# Altium schematic sheet TopLevel.SCHDOC
size A4
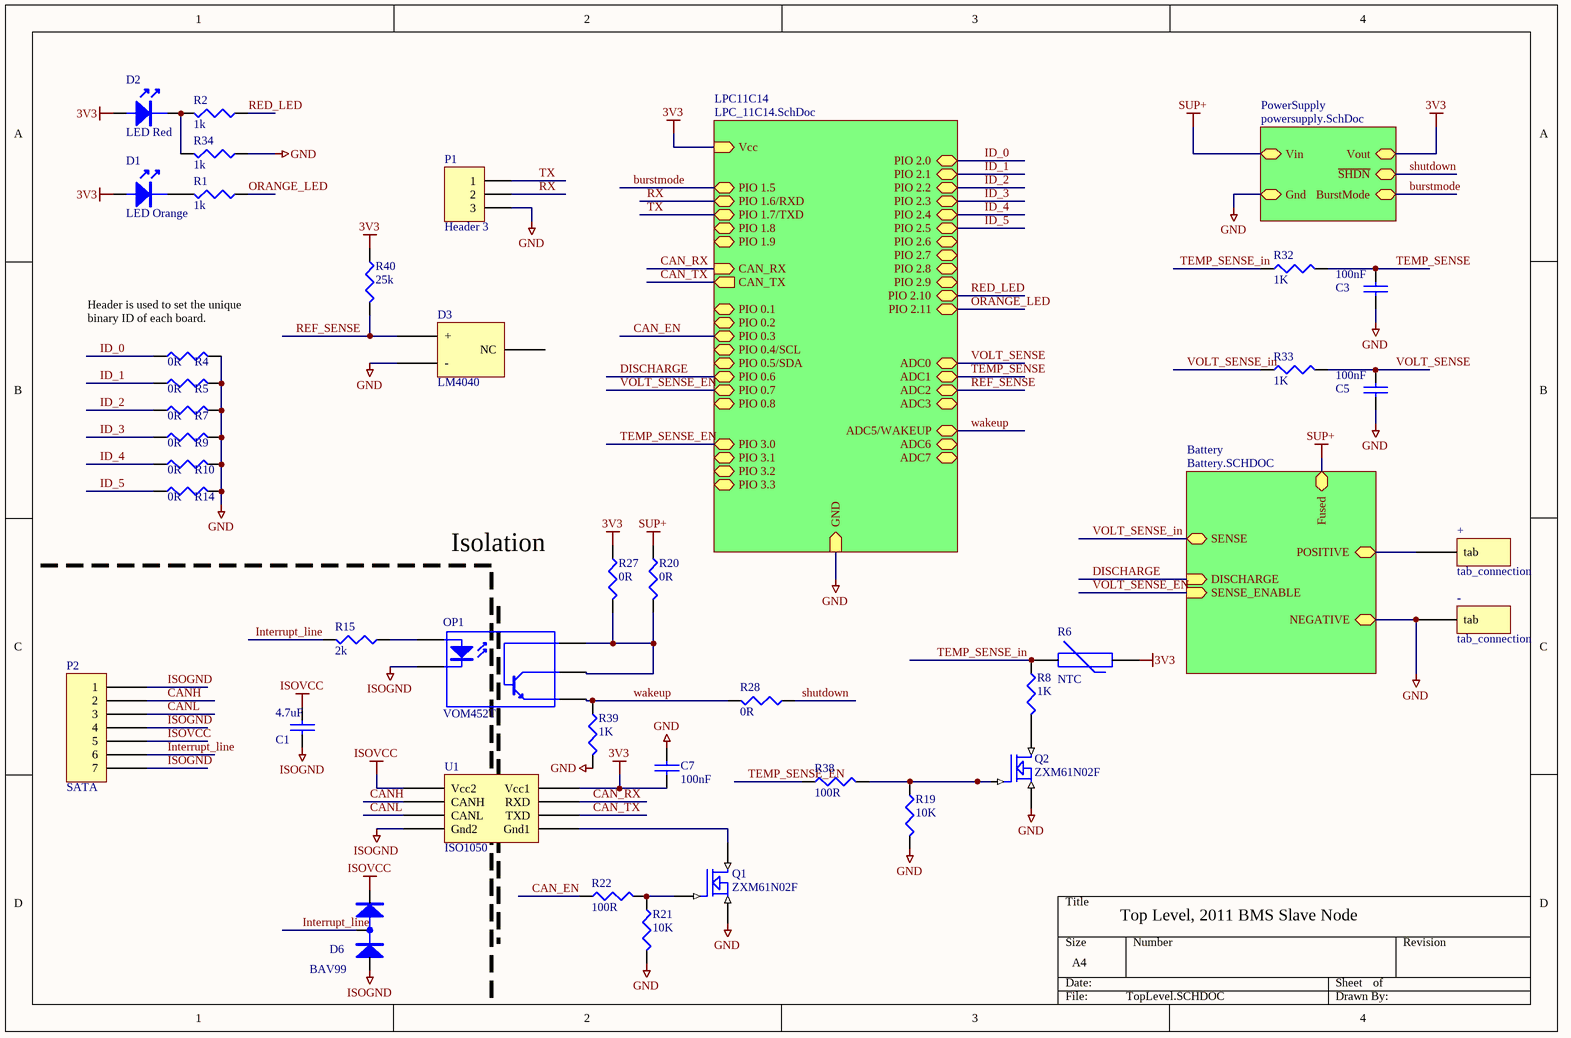
[diagram p0: TopLevel.SCHDOC]

## Parts
+  tab_connection  [tab_connect]
-  tab_connection  [tab_connect]
C1  4.7uF  [0805]
C3  100nF  [0603]
C5  100nF  [0603]
C7  100nF  [0603]
D1  LED Orange  [0603_LED]
D2  LED Red  [0603_LED]
D3  LM4040  [SOT23-3]
D6  BAV99  [BAV99]
OP1  VOM452T  [VOM452T]
P1  Header 3  [HDR1X3]
P2  SATA  [47080-4005-SATA]
Q1  ZXM61N02F  [SOT23-3]
Q2  ZXM61N02F  [SOT23-3]
R1  1k  [0603]
R2  1k  [0603]
R4  0R  [0603]
R5  0R  [0603]
R6  NTC  [MHDR1X2]
R7  0R  [0603]
R8  1K  [0603]
R9  0R  [0603]
R10  0R  [0603]
R14  0R  [0603]
R15  2k  [0603]
R19  10K  [0603]
R20  0R  [0603]
R21  10K  [0603]
R22  100R  [0603]
R27  0R  [0603]
R28  0R  [0603]
R32  1K  [0603]
R33  1K  [0603]
R34  1k  [0603]
R38  100R  [0603]
R39  1K  [0603]
R40  25k  [0603]
U1  ISO1050  [SOP8]

## Sub-sheets
Battery = Battery.SCHDOC: DISCHARGE (in), SENSE_ENABLE (in), SENSE (bidir), Fused, POSITIVE, NEGATIVE
LPC11C14 = LPC_11C14.SchDoc: ADC5/WAKEUP (bidir), ADC6 (bidir), CAN_TX (out), CAN_RX (in), ADC7, Vcc (in), GND (in), ADC3 (bidir), ADC2 (bidir), ADC1 (bidir), ADC0 (bidir), PIO 0.4/SCL (bidir), PIO 0.5/SDA (bidir), PIO 0.7 (bidir), PIO 0.6 (bidir), PIO 0.1 (bidir), PIO 0.2, PIO 0.3, PIO 0.8, PIO 1.6/RXD (bidir), PIO 1.7/TXD (bidir), PIO 1.5, PIO 1.8, PIO 1.9, PIO 3.0 (bidir), PIO 3.1 (bidir), PIO 3.2, PIO 3.3, PIO 2.9 (bidir), PIO 2.8 (bidir), PIO 2.7 (bidir), PIO 2.11 (bidir), PIO 2.10 (bidir), PIO 2.3 (bidir), PIO 2.2 (bidir), PIO 2.1 (bidir), PIO 2.6, PIO 2.0, PIO 2.4, PIO 2.5
PowerSupply = powersupply.SchDoc: Vin, Vout, Gnd, BurstMode, ~{SHDN}

## Nets
3V3: C7.1 D1.A D2.A R6.2 R27.1 R40.1 U1.1(Vcc1) ; sheet LPC11C14/Vcc, sheet PowerSupply/Vout
GND: -.0(tab) C3.2 C5.2 C7.2 D3.2(-) P1.3 Q1.2(S) Q2.2(S) R4.2 R5.2 R7.2 R9.2 R10.2 R14.2 R19.2 R21.2 R34.1 R39.2 ; sheet Battery/NEGATIVE, sheet LPC11C14/GND, sheet PowerSupply/Gnd
ISOGND: C1.2 D6.A OP1.3(K) P2.1 P2.4 P2.7 U1.5(Gnd2)
ISOVCC: C1.1 D6.K P2.5 U1.8(Vcc2)
SUP+: R20.1 ; sheet Battery/Fused, sheet PowerSupply/Vin
burstmode: sheet LPC11C14/PIO 1.5, sheet PowerSupply/BurstMode
CAN_EN: R22.1 ; sheet LPC11C14/PIO 0.3
CAN_RX: U1.2(RXD) ; sheet LPC11C14/CAN_RX
CAN_TX: U1.3(TXD) ; sheet LPC11C14/CAN_TX
CANH: P2.2 U1.7(CANH)
CANL: P2.3 U1.6(CANL)
DISCHARGE: sheet Battery/DISCHARGE, sheet LPC11C14/PIO 0.6
ID_0: R4.1 ; sheet LPC11C14/PIO 2.0
ID_1: R5.1 ; sheet LPC11C14/PIO 2.1
ID_2: R7.1 ; sheet LPC11C14/PIO 2.2
ID_3: R9.1 ; sheet LPC11C14/PIO 2.3
ID_4: R10.1 ; sheet LPC11C14/PIO 2.4
ID_5: R14.1 ; sheet LPC11C14/PIO 2.5
Interrupt_line: D6.C P2.6 R15.2
ORANGE_LED: R1.1 ; sheet LPC11C14/PIO 2.11
RED_LED: R2.1 ; sheet LPC11C14/PIO 2.10
REF_SENSE: D3.1(+) R40.2 ; sheet LPC11C14/ADC2
RX: P1.2 ; sheet LPC11C14/PIO 1.6/RXD
shutdown: R28.1 ; sheet PowerSupply/~{SHDN}
TEMP_SENSE: C3.1 R32.2 ; sheet LPC11C14/ADC1
TEMP_SENSE_EN: R38.1 ; sheet LPC11C14/PIO 3.0
TEMP_SENSE_in: R6.1 R8.1 R32.1
TX: P1.1 ; sheet LPC11C14/PIO 1.7/TXD
VOLT_SENSE: C5.1 R33.2 ; sheet LPC11C14/ADC0
VOLT_SENSE_EN: sheet Battery/SENSE_ENABLE, sheet LPC11C14/PIO 0.7
VOLT_SENSE_in: R33.1 ; sheet Battery/SENSE
wakeup: OP1.4(E) R28.2 R39.1 ; sheet LPC11C14/ADC5/WAKEUP
Net+_0: +.0(tab) ; sheet Battery/POSITIVE
NetD1_K: D1.K R1.2
NetD2_K: D2.K R2.2 R34.2
NetOP1_1: OP1.1(A) R15.1
NetOP1_5: OP1.5(C) OP1.6(C) R20.2 R27.2
NetQ1_1: Q1.1(G) R21.1 R22.2
NetQ1_3: Q1.3(D) U1.4(Gnd1)
NetQ2_1: Q2.1(G) R19.1 R38.2
NetQ2_3: Q2.3(D) R8.2

Not connected (* = marked no-connect by the designer): D3 3(NC)

## Notes on the sheet
- (near R4) Header is used to set the unique binary ID of each board.
- (near R27) Isolation
- Top Level, 2011 BMS Slave Node

## Library data of the parts
C1 = CAP: Capacitor; Value: 100nF; Needed?: NO - HW LAB
C3 C5 C7 = CAP: Capacitor; Needed?: NO - HW LAB; Value: 100nF
D1 = LED: Order#: 3225148; Price: 0.99; Supplier: Farnell
D2 = LED: Order#: 5790840; Price: 0.385; Supplier: Farnell
D6 = DIODE SERIES 2: diode, series connected; Order#: 741-000; Price: 0.223; Supplier: Farnell
P1 = Header 3: Header, 3-Pin; LatestRevisionDate: 17-Jul-2002; LatestRevisionNote: Re-released for DXP Platform.; Publisher: Altium Limited
Q1 Q2 = ZXM61N02F: 1.7A, 20V N-Channel Enhancement mode FET; Order#: 9525270; Price: 0.803; Supplier: Farnell
R1 R2 R4 R5 R7 R9 R10 R14 R19 R21 R22 R34 R38 = RES1: Resistor; Order#: 9233253; Price: 0.088; Supplier: Farnell
R6 = NTC: Thermistor, NTC; Order#: 1187036; Supplier: Farnell; Price: 2.23
R8 R15 R20 R27 R28 R32 R33 R39 R40 = RES1: Resistor; Order#: 9330380; Supplier: Farnell; Price: 0.066